# Altium schematic sheet USBC.SchDoc
size A4; SheetNumber: 7; SheetTotal: 9
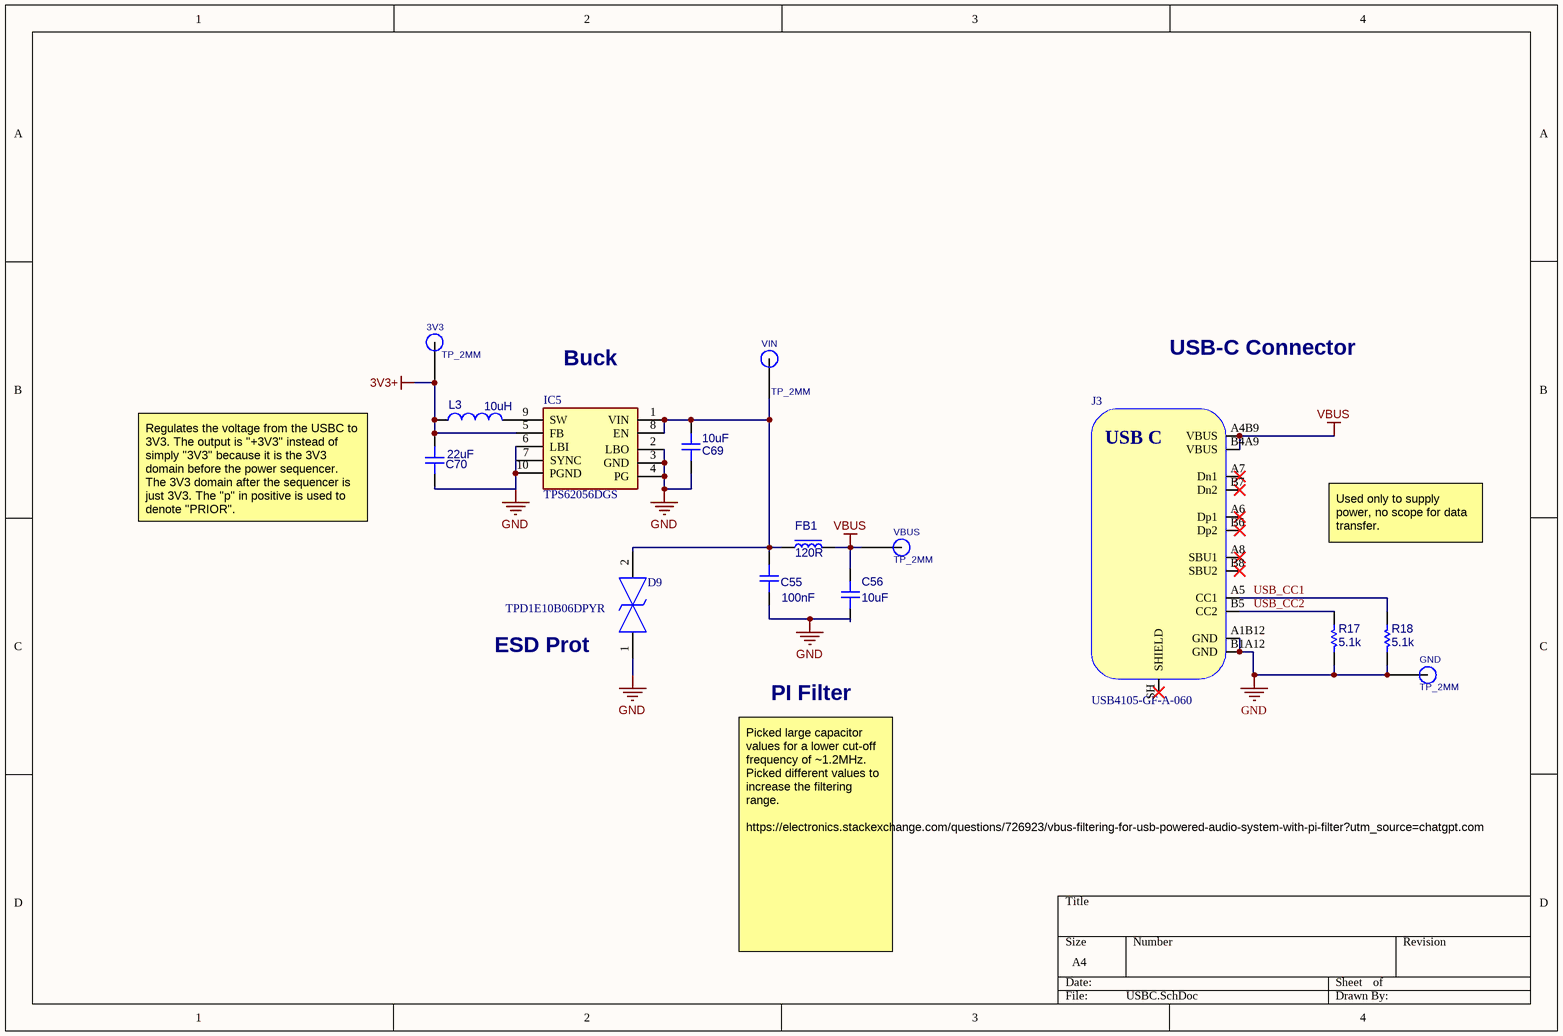
[diagram p0: USBC.SchDoc]

## Parts
3V3  TP_2MM  [TESTPOINT 2MM]
C55  CAP_0603_16V  [CAP_0603]  (value not drawn)
C56  CAP_0603_16V  [CAP_0603]  (value not drawn)
C69  CAP_0603_16V  [CAP_0603]  (value not drawn)
C70  CAP_0603_16V  [CAP_0603]  (value not drawn)
D9  TPD1E10B06DPYR  [TPD1E10B06DPYR]
FB1  120R  [FB_0603]
GND  TP_2MM  [TESTPOINT 2MM]
IC5  TPS62056DGS  [TPS62056DGS]
J3  USB4105-GF-A-060  [USB4105-GF-A-060]
L3  10uH  [INDC1608X90X30LL10T20]
R17  value 5.1k  [RESC1608X55X25ML10T15-1]  (hidden comment: Resistor 10k +/-1% 0603 100mW)
R18  value 5.1k  [RESC1608X55X25ML10T15-1]  (hidden comment: Resistor 10k +/-1% 0603 100mW)
VBUS  TP_2MM  [TESTPOINT 2MM]
VIN  TP_2MM  [TESTPOINT 2MM]

## Nets
3V3+: 3V3.TP(TP_2MM) C70.2 IC5.5(FB) L3.1
GND: C55.1 C56.1 C69.1 C70.1 D9.1 GND.TP(TP_2MM) IC5.2(LBO) IC5.3(GND) IC5.4(PG) IC5.6(LBI) IC5.7(SYNC) IC5.10(PGND) J3.A1B12(GND) J3.B1A12(GND) R17.2 R18.2
VBUS: C56.2 FB1.2 J3.A4B9(VBUS) J3.B4A9(VBUS) VBUS.TP(TP_2MM)
USB_CC1: J3.A5(CC1) R18.1
USB_CC2: J3.B5(CC2) R17.1
NetC55_2: C55.2 C69.2 D9.2 FB1.1 IC5.1(VIN) IC5.8(EN) VIN.TP(TP_2MM)
NetIC5_9: IC5.9(SW) L3.2

Not connected (* = marked no-connect by the designer): J3 A6(Dp1)* A7(Dn1)* A8(SBU1)* B6(Dp2)* B7(Dn2)* B8(SBU2)* SH(SHIELD)*

## Notes on the sheet
- (near IC5) Buck
- USB-C Connector
- (near C69) 10uF
- Regulates the voltage from the USBC to 3V3. The output is "+3V3" instead of simply "3V3" because it is the 3V3 domain before the power sequencer. The 3V3 domain after the sequencer is just 3V3. The "p" in positive is used to denote "PRIOR".
- (near C70) 22uF
- Used only to supply power, no scope for data transfer.
- (near D9) ESD Prot
- (near C55) 100nF
- (near C56) 10uF
- PI Filter
- Picked large capacitor values for a lower cut-off frequency of ~1.2MHz. Picked different values to increase the filtering range.
  https://electronics.stackexchange.com/questions/726923/vbus-filtering-for-usb-powered-audio-system-with-pi-filter?utm_source=chatgpt.com
- (in symbol CMP-005-000042-4) USB C

## Library data of the parts
C55 C56 C69 C70 = CMP-004-000035-1: Capacitor SMD 0603 16V; Source: Schematic-Lib-PhilsLab.SchLib; Design Item ID: CAP_0603_16V
D9 = TPD1E10B06DPYR: TVS Diode (Bi-directional); Manufacturer_Name: Texas Instruments; Datasheet Link: https://www.ti.com/lit/ds/symlink/tpd1e10b06.pdf?HQS=TI-null-null-mousermode-df-pf-null-wwe&ts=1599077798252&ref_url=https%253A%252F%252Fwww.mouser.com%252F; Height: 0.45mm; Manufacturer_Part_Number: TPD1E10B06DPYR; Mouser Part Number: 595-TPD1E10B06DPYR; Mouser Price/Stock: https://www.mouser.co.uk/ProductDetail/Texas-Instruments/TPD1E10B06DPYR?qs=UFc95S4Z4CaJYpQ4xqTc0g%3D%3D; Arrow Part Number: TPD1E10B06DPYR; Arrow Price/Stock: https://www.arrow.com/en/products/tpd1e10b06dpyr/texas-instruments?region=nac
FB1 = CMP-010-000008-1: Ferrite Bead SMD 0603; Source: Schematic-Lib-PhilsLab.SchLib; Design Item ID: FB_0603
IC5 = TPS62056DGS: Integrated Circuit; Manufacturer_Name: Texas Instruments; Datasheet Link: http://componentsearchengine.com/Datasheets/1/TPS62056DGS.pdf; Height: 1.1mm; Manufacturer_Part_Number: TPS62056DGS; Mouser Part Number: 595-TPS62056DGS; Mouser Price/Stock: https://www.mouser.co.uk/ProductDetail/Texas-Instruments/TPS62056DGS?qs=Gse6rAGbi7%252BfbVYUmz7rjA%3D%3D; Arrow Part Number: TPS62056DGS; Arrow Price/Stock: https://www.arrow.com/en/products/tps62056dgs/texas-instruments?region=nac
J3 = CMP-005-000042-4: USB Connector Type C SMT 12 Pin; Manufacturer: GCT; Manufacturer Part Number: USB4105-GF-A-060; Source: Schematic-Lib-PhilsLab.SchLib; Design Item ID: USB4105-GF-A-060
L3 = CMP-2000-05913-1: Unshielded Wirewound Inductor, 33 nH, 350 mA, -55 to 150 degC, 0603 (1608 Metric), RoHS, Tape and Reel; Manufacturer: EPCOS-(TDK); Q @ Freq: 14@100MHz; Inductance: 33nH; Material - Core: Ceramic; Frequency - Self Resonant: 3GHz; DC Resistance (DCR): 600mOhmMax; Tolerance: ±5%; Frequency - Test: 100MHz; Current Rating: 350mA; Manufacturer URL: http://www.tdk.com/; Type: Wirewound; Mounting Type: SurfaceMount; Mounting Technology: SurfaceMount; Height - Seated (Max): 0.035"(0.90mm); Datasheet URL: https://en.tdk.eu/inf/30/db/ind_2008/b82496c.pdf; Shielding: Unshielded; Operating Temperature: -; Size / Dimension: 0.063"Lx0.031"W(1.60mmx0.80mm); Series: SIMID; Current - Saturation: -; Ratings: AEC-Q200; Packaging: CutTape(CT); Package Reference: 0603; Datasheet Version: 07/2016; Category: Inductors,Coils,Chokes; Package Description: 2-Pin Surface Mount Device, Body 1.6 x 0.8 mm; Family: FixedInductors; Package / Case: 0603(1608Metric)
R17 R18 = CMP-009-00181-1: Chip Resistor, 10k Ohm, 0.1 W, -55 to 155 degC, 0603 (1608 Metric); Voltage Rating: 50V; Tolerance: 1%; Source: Components - 14.11.22 - 11.28.SchLib; Design Item ID: CMP-009-00006-5; Created by: Micah Randall; Power: 100mW; Max Operating Temperature: 155°C; RoHS Compliant: Yes; Mounting Technology: SM; Case/Package: 0603; Min Operating Temperature: -55°C; Pins: 2